# Altium schematic sheet IR.SchDoc
size A
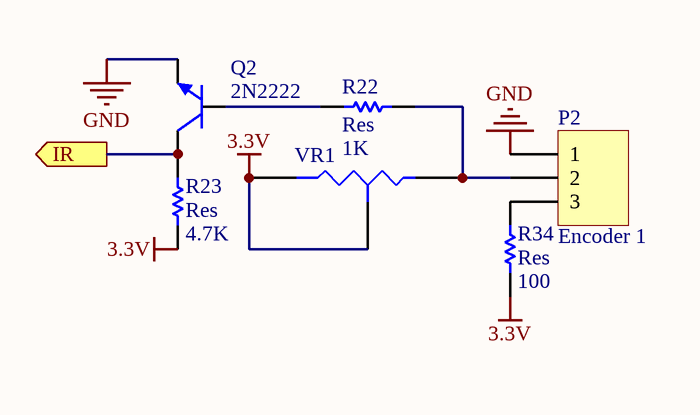
[diagram p0: IR.SchDoc]

## Parts
P2  Encoder 1  [HDR1X3]
Q2  2N2222  [SOT-23]
R22  Res  value 1K  [2012[0805]]
R23  Res  value 4.7K  [2012[0805]]
R34  Res  value 100  [2012[0805]]
VR1  Res Tap  [MULTITURN]  (value not drawn)

## Ports
IR (out)

## Nets
3.3V: R23.1 R34.1 VR1.2(B) VR1.3(TAP)
GND: P2.1 Q2.3(E)
IR: Q2.1(C) R23.2 ; port IR
NetP2_2: P2.2 R22.2 VR1.1(A)
NetP2_3: P2.3 R34.2
NetQ2_2: Q2.2(B) R22.1

## Library data of the parts
P2 = Header 3: Header, 3-Pin; LatestRevisionDate: 17-Jul-2002; LatestRevisionNote: Re-released for DXP Platform.; Publisher: Altium Limited
Q2 = 2N2222: NPN Bipolar Transistor; Published: 8-Jun-2000; LatestRevisionDate: 17-Jul-2002; LatestRevisionNote: Re-released for DXP Platform.; PackageReference: TO-226; Publisher: Altium Limited; Code_JEDEC: TO-226-AA
R22 R23 R34 = Res: Semiconductor Resistor; Published: 8-Jun-2000; LatestRevisionDate: 17-Jul-2002; LatestRevisionNote: Re-released for DXP Platform.; PackageReference: AXIAL-0.5; Publisher: Altium Limited
VR1 = Res Tap: Tapped Resistor; Sim Note: Enter the Resistance value and the set point into parameter fields.; Set Position: 0.5; Published: 24-Mar-1999; LatestRevisionDate: 17-Jul-2002; LatestRevisionNote: Re-released for DXP Platform.; PackageReference: VR3; Publisher: Altium Limited